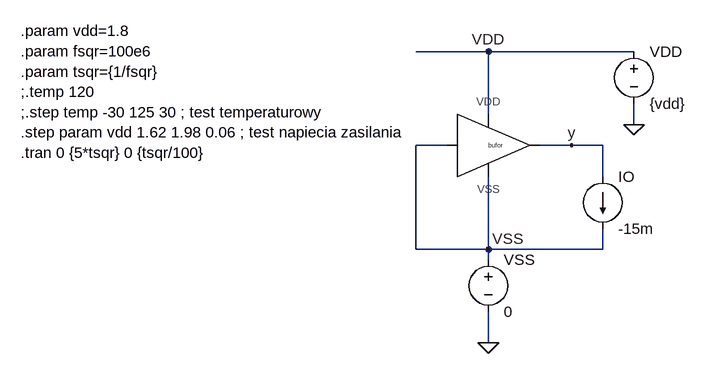
[diagram p0: schematic BUF-test-prad.asc]
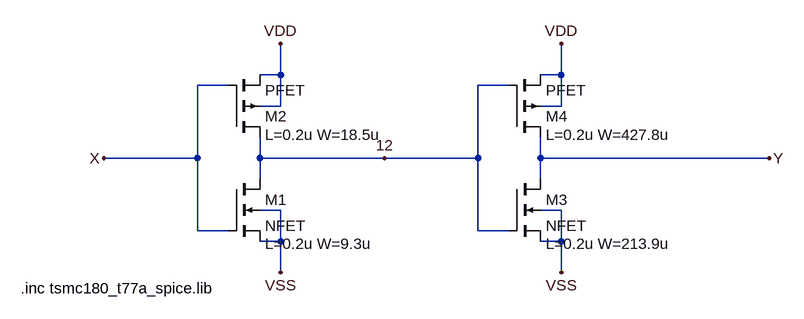
[diagram p1: sub-circuit buf.asc]
BUF-test-prad.asc, the LTspice schematic file:
Version 4
SHEET 1 880 680
WIRE 192 16 80 16
WIRE 416 16 192 16
WIRE 192 112 192 16
WIRE 416 128 416 96
WIRE 128 160 80 160
WIRE 320 160 272 160
WIRE 368 160 320 160
WIRE 368 208 368 160
WIRE 80 320 80 160
WIRE 192 320 192 208
WIRE 192 320 80 320
WIRE 368 320 368 288
WIRE 368 320 192 320
WIRE 192 336 192 320
WIRE 192 464 192 416
FLAG 416 128 0
FLAG 192 464 0
FLAG 320 160 y
FLAG 192 16 VDD
FLAG 192 320 VSS
SYMBOL BUF 192 160 R0
WINDOW 0 0 0 Left 0
SYMATTR InstName bufor
SYMBOL voltage 416 0 R0
WINDOW 123 0 0 Left 0
WINDOW 39 0 0 Left 0
SYMATTR InstName VDD
SYMATTR Value {vdd}
SYMBOL voltage 192 320 R0
WINDOW 123 0 0 Left 0
WINDOW 39 0 0 Left 0
SYMATTR InstName VSS
SYMATTR Value 0
SYMBOL current 368 208 R0
WINDOW 123 0 0 Left 0
WINDOW 39 0 0 Left 0
SYMATTR InstName IO
SYMATTR Value -15m
TEXT -528 -16 Left 2 !.param vdd=1.8\n.param fsqr=100e6\n.param tsqr={1/fsqr}\n;.temp 120\n;.step temp -30 125 30 ; test temperaturowy\n.step param vdd 1.62 1.98 0.06 ; test napiecia zasilania\n.tran 0 {5*tsqr} 0 {tsqr/100}

buf.asc, the sub-circuit schematic file:
Version 4
SHEET 1 1496 680
WIRE 672 -16 672 -64
WIRE 672 -16 640 -16
WIRE 1104 -16 1104 -64
WIRE 1104 -16 1072 -16
WIRE 592 0 544 0
WIRE 1024 0 976 0
WIRE 672 32 672 -16
WIRE 672 32 640 32
WIRE 1104 32 1104 -16
WIRE 1104 32 1072 32
WIRE 544 112 544 0
WIRE 544 112 400 112
WIRE 640 112 640 80
WIRE 832 112 640 112
WIRE 976 112 976 0
WIRE 976 112 832 112
WIRE 1072 112 1072 80
WIRE 1424 112 1072 112
WIRE 640 144 640 112
WIRE 1072 144 1072 112
WIRE 672 192 640 192
WIRE 1104 192 1072 192
WIRE 544 224 544 112
WIRE 592 224 544 224
WIRE 976 224 976 112
WIRE 1024 224 976 224
WIRE 672 240 672 192
WIRE 672 240 640 240
WIRE 1104 240 1104 192
WIRE 1104 240 1072 240
WIRE 672 288 672 240
WIRE 1104 288 1104 240
FLAG 1424 112 Y
FLAG 400 112 X
FLAG 672 -64 VDD
FLAG 1104 -64 VDD
FLAG 672 288 VSS
FLAG 1104 288 VSS
FLAG 832 112 12
SYMBOL nmos4 592 144 R0
WINDOW 123 56 100 Left 2
SYMATTR Value2 L=0.2u W=9.3u
SYMATTR InstName M1
SYMATTR Value NFET
SYMBOL pmos4 592 80 M180
WINDOW 123 56 4 Left 2
SYMATTR Value2 L=0.2u W=18.5u
SYMATTR InstName M2
SYMATTR Value PFET
SYMBOL nmos4 1024 144 R0
WINDOW 123 56 100 Left 2
SYMATTR Value2 L=0.2u W=213.9u
SYMATTR InstName M3
SYMATTR Value NFET
SYMBOL pmos4 1024 80 M180
WINDOW 123 56 4 Left 2
SYMATTR Value2 L=0.2u W=427.8u
SYMATTR InstName M4
SYMATTR Value PFET
TEXT 272 312 Left 2 !.inc tsmc180_t77a_spice.lib

The netlist it stands for:
* BUF-test-prad.asc
Xbufor VSS y VDD VSS buf
VDD VDD 0 {vdd}
VSS VSS 0 0
IO y VSS -15m

* block symbol definitions
.subckt buf X Y VDD VSS
M1 12 X VSS VSS NFET L=0.2u W=9.3u
M2 12 X VDD VDD PFET L=0.2u W=18.5u
M3 Y 12 VSS VSS NFET L=0.2u W=213.9u
M4 Y 12 VDD VDD PFET L=0.2u W=427.8u
.inc tsmc180_t77a_spice.lib
.ends buf

.model NMOS NMOS
.model PMOS PMOS
.lib standard.mos
.param vdd=1.8
.param fsqr=100e6
.param tsqr={1/fsqr}
;.temp 120
;.step temp -30 125 30 ; test temperaturowy
.step param vdd 1.62 1.98 0.06 ; test napiecia zasilania
.tran 0 {5*tsqr} 0 {tsqr/100}
.backanno
.end